# EasyEDA schematic Sheet_1.json
REV: 1.0; Date: 2023-01-23; Sheet: 1/1; Drawn By: mohang; Company: Your Company
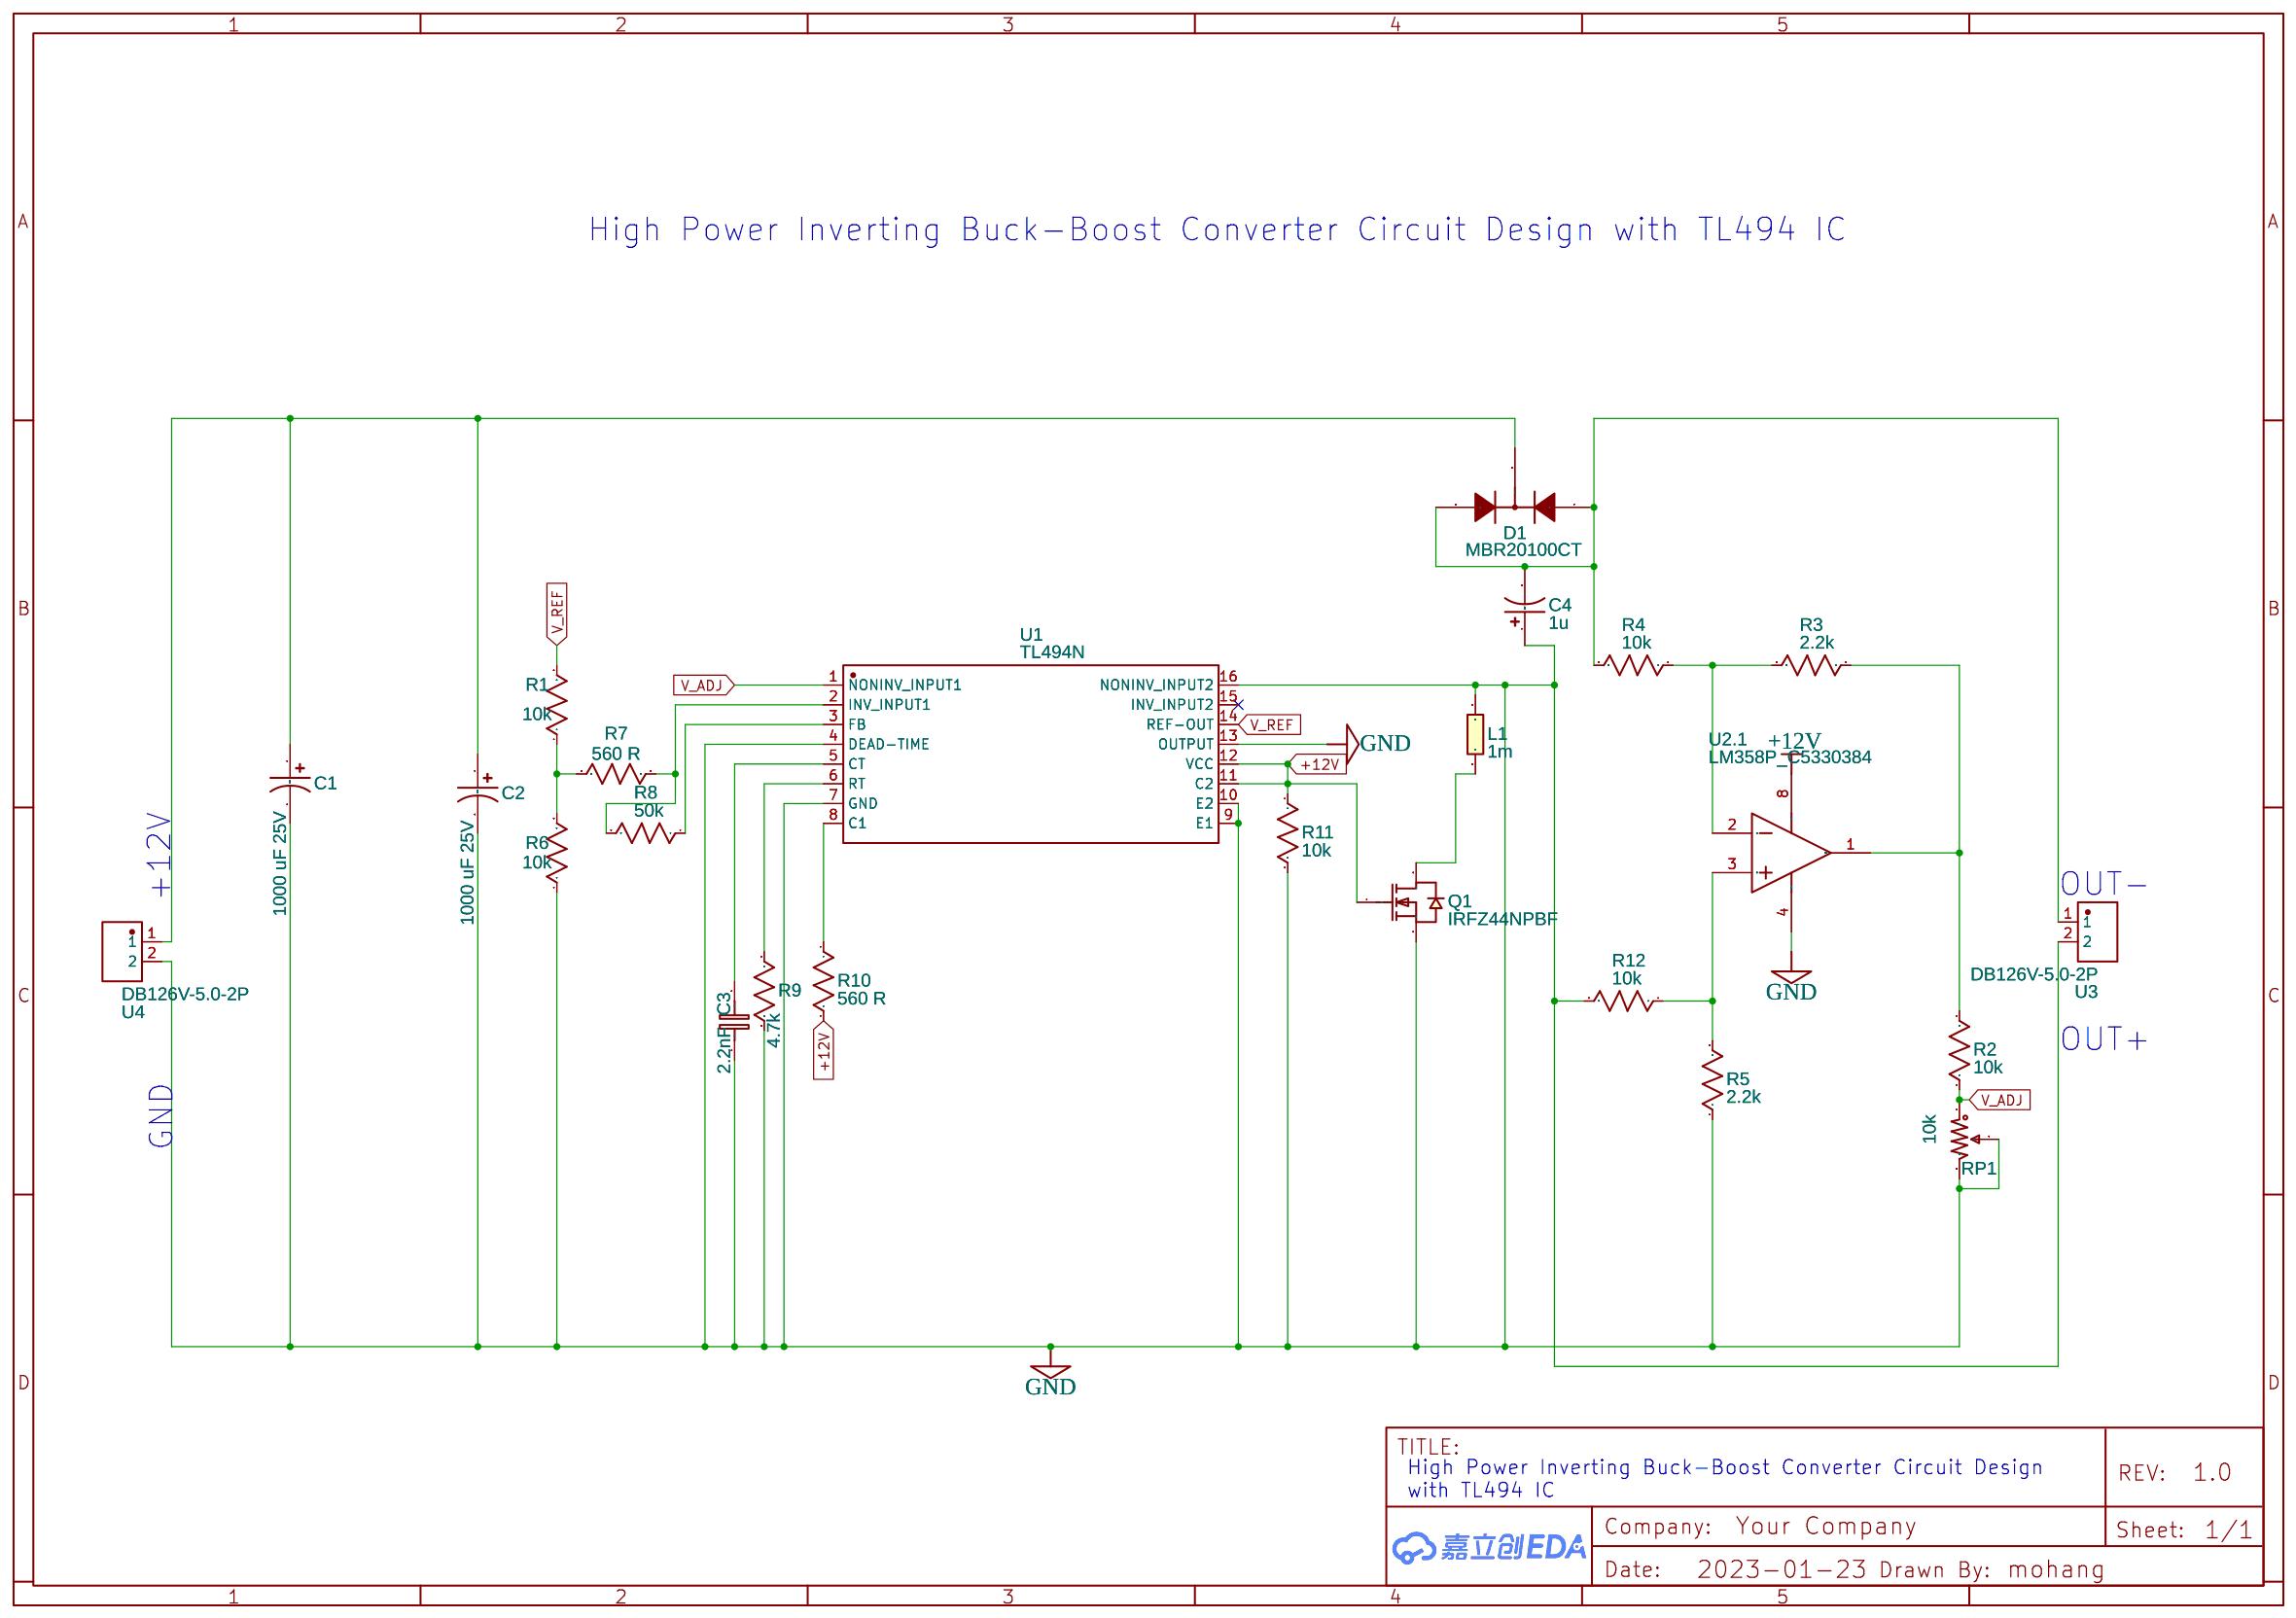
[diagram p0: schematic sheet]

## Parts
C1  1000 uF 25V  [CASE-A_3216]
C2  1000 uF 25V  [CASE-A_3216]
C3  2.2nF  [C0603]
C4  1u  [CASE-A_3216]
D1  MBR20100CT  [TO-220-3_L10.0-W4.5-P2.54-L]
L1  1m  [L0603]
Q1  IRFZ44NPBF  [TO-220-3_L10.0-W4.5-P2.54-L]
R1  10k  [R0603]
R2  10k  [R0603]
R3  2.2k  [R0603]
R4  10k  [R0603]
R5  2.2k  [R0603]
R6  10k  [R0603]
R7  560 R  [R0603]
R8  50k  [R0603]
R9  4.7k  [R0603]
R10  560 R  [R0603]
R11  10k  [R0603]
R12  10k  [R0603]
RP1  10k  [RES-ADJ-TH_3386P]
U1  TL494N  [DIP-16_L19.8-W6.5-P2.54-LS7.6-BL]
U2  LM358P_C5330384  [DIP-8_L9.7-W6.4-P2.54-LS7.6-BL]  (section 1)
U3  DB126V-5.0-2P  [CONN-TH_2P-P5.00_L7.8-W10.0]
U4  DB126V-5.0-2P  [CONN-TH_2P-P5.00_L7.8-W10.0]

## Library data of the parts
C1 = C_Tan_SMD_A_US: Contributor: LCEDA_Lib; Package Display: No
C2 C4 = C_Tan_SMD_A_US: Contributor: LCEDA_Lib
C3 = C_0603_EU: Contributor: LCEDA_Lib
D1 = MBR20100CT: Supplier: LCSC; Manufacturer: CJ(江苏长电/长晶); Supplier Part: C98706; JLCPCB Part Class: Extended Part
L1 = L0603_EU: Contributor: LCEDA_Lib
Q1 = IRFZ44NPBF: Supplier: LCSC; Manufacturer: Infineon(英飞凌); Supplier Part: C2586; JLCPCB Part Class: Extended Part
R1-R12 = R_0603_US: Contributor: LCEDA_Lib
RP1 = R_3386P_US: Supplier: LCSC; Contributor: LCEDA_Lib; value(Ω): 10K
U1 = TL494N: Supplier: LCSC; Supplier Part: C596329; Manufacturer: HTC; Contributor: LCSC; JLCPCB Part Class: Extended Part
U2 = LM358P_C5330384: Supplier: LCSC; Supplier Part: C5330384; Manufacturer: Slkor(萨科微); Manufacturer Part: LM358P; subpart_no: 1
U3 U4 = DB126V-5.0-2P: Supplier: LCSC; Supplier Part: C395849; Manufacturer: DIBO(地博电气); Manufacturer Part: DB126V-5.0-2P-GN-P; Contributor: LCSC; JLCPCB Part Class: Extended Part

## Nets
+12V: Q1.1(G) R10.2 R11.1 U1.11(C2) U1.12(VCC) U2.8(VCC)
GND: C1.2 C2.2 C3.1 C4.1 L1.1 Q1.3(S) R5.1 R6.1 R9.2 R11.2 R12.2 RP1.2 RP1.3 U1.4(DEAD-TIME) U1.7(GND) U1.9(E1) U1.10(E2) U1.13(OUTPUT) U1.16(NONINV INPUT2) U2.4(GND) U3.2 U4.2
V_ADJ: R2.1 RP1.1 U1.1(NONINV INPUT1)
V_REF: R1.2 U1.14(REF-OUT)
Net-(C1-1): C1.1 C2.1 D1.2(C) U4.1
Net-(C3-2): C3.2 U1.5(CT)
Net-(C4-2): C4.2 D1.1(A) D1.3(A) R4.2 U3.1
Net-(L1-2): L1.2 Q1.2(D)
Net-(R1-1): R1.1 R6.2 R7.2
Net-(R2-2): R2.2 R3.1 U2.1(OUT1)
Net-(R3-2): R3.2 R4.1 U2.2(IN1-)
Net-(R5-2): R5.2 R12.1 U2.3(IN1+)
Net-(R7-1): R7.1 R8.2 U1.2(INV INPUT1)
Net-(R8-1): R8.1 U1.3(FB)
Net-(R9-1): R9.1 U1.6(RT)
Net-(R10-1): R10.1 U1.8(C1)

Not connected (* = marked no-connect by the designer): U1 15(INV INPUT2)*

## Notes on the sheet
- High Power Inverting Buck-Boost Converter Circuit Design with TL494 IC
- OUT-
- +12V
- OUT+
- GND
- High Power Inverting Buck-Boost Converter Circuit Design
  with TL494 IC
